# EasyEDA Pro project split-keyboard.epro, board PCB8_2
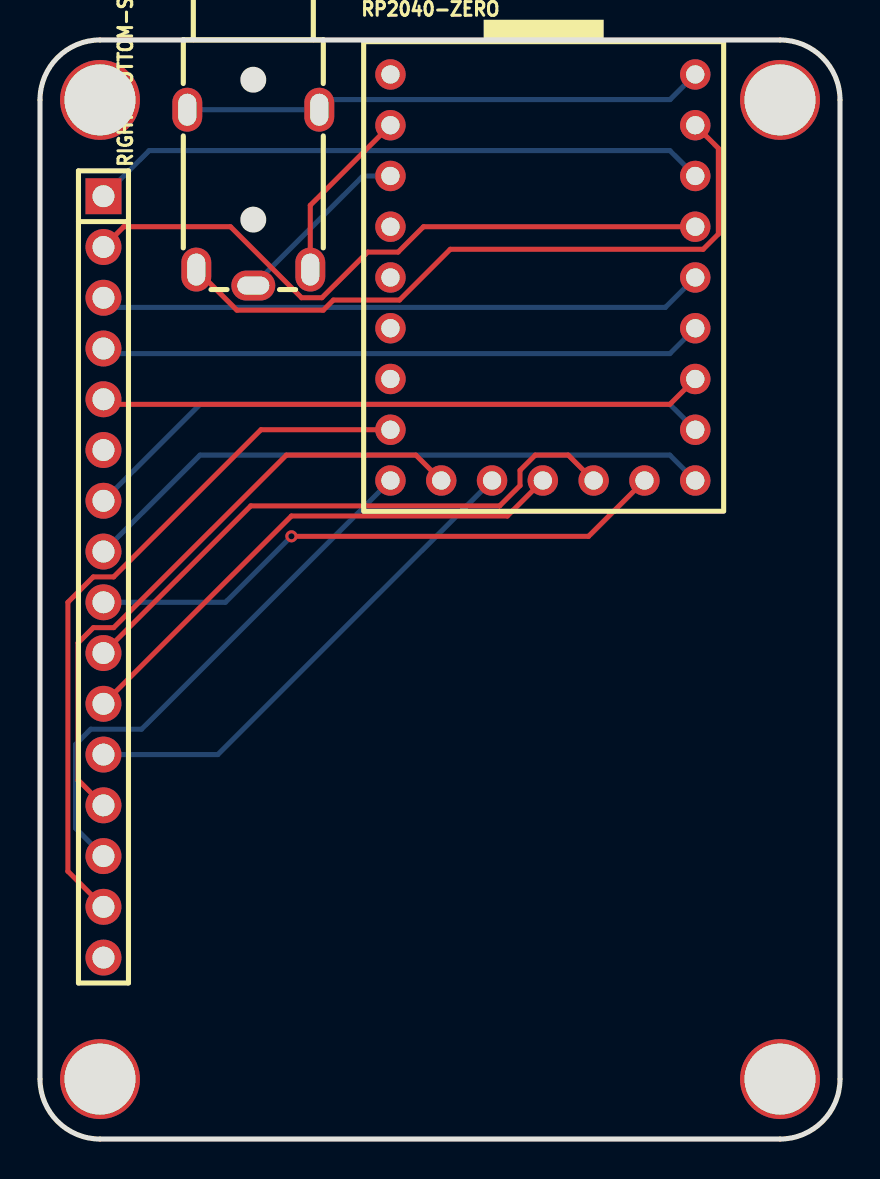
[diagram p9: board, top side]
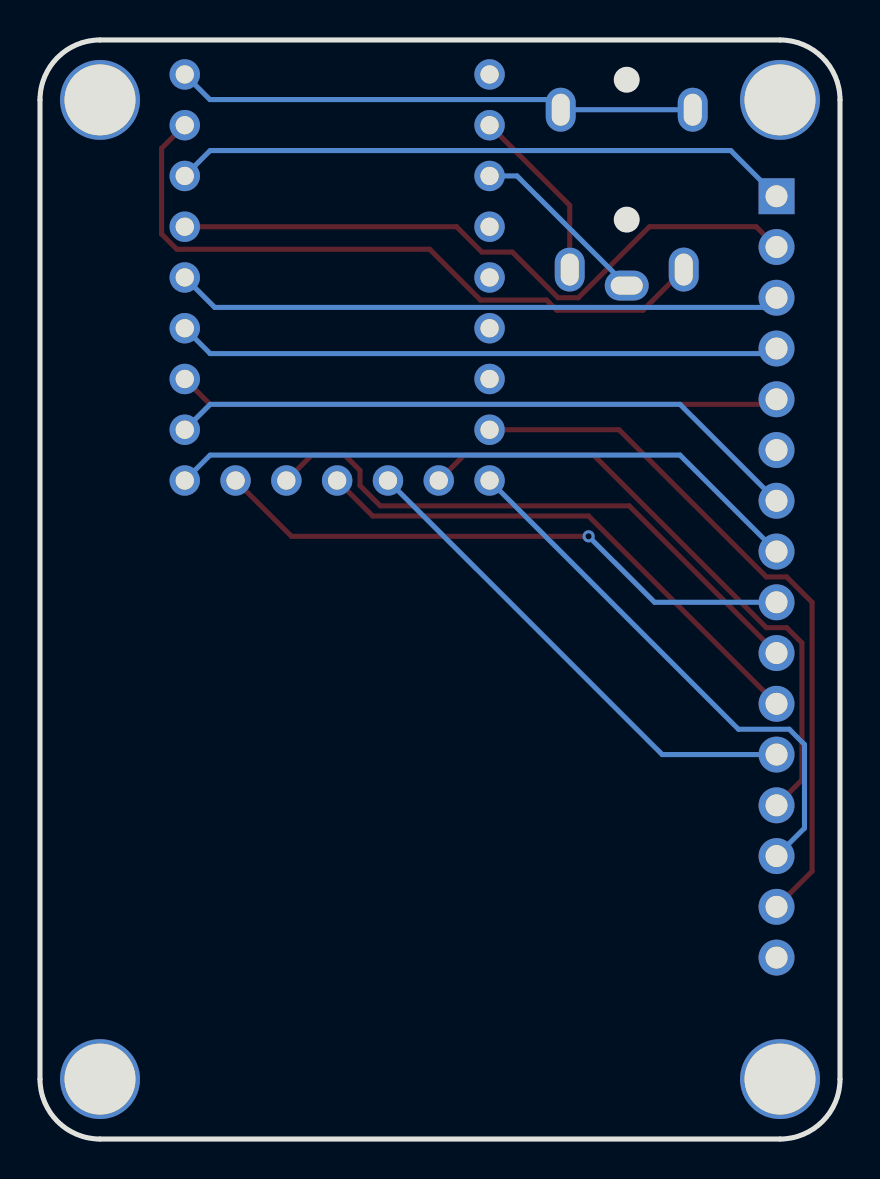
[diagram p10: board, bottom side, seen from below]

Outline 40 x 55 mm; copper layers: Top Layer, Bottom Layer. Coordinates in mm from the lower left corner of the outline.
Outline path: 0,52 0,3 arc(0.88,0.88) 3,0 37,0 arc(39.12,0.88) 40,3 40,52 arc(39.12,54.12) 37,55 3,55 arc(0.88,54.12) 0,52
Stack: Top Layer 0.035mm / Dielectric1 1.51mm FR4 er 4.5 / Bottom Layer 0.035mm

## Design rules (mm)
template: JLCPCB Capability(Two Layers Board)
spacing copperThickness1oz (default): track to track 0.102, other pairs 0.152 to 0.3
spacing copperThickness2oz: track to track 0.203, other pairs 0.152 to 0.3
track width copperThickness1oz (default): min 0.127, default 0.254, max 2.54
track width copperThickness2oz: min 0.203, default 0.254, max 2.54
differential pair differentialPair (default): width min 0.127, default 0.254, max 2.54; gap min 0.152, default 0.152
via viaSize (default): diameter min 0.5, default 0.61, max 10; hole min 0.3, default 0.305, max 6.3

## Placement (name value [footprint] x y rotation side)
NOREF  -  [Pad_e8]  37 52 0 top
NOREF#2  -  [Pad_e3]  3 52 0 top
NOREF#3  -  [Pad_e11]  37 3 0 top
NOREF#4  -  [Pad_e10]  3 3 0 top
RIGHT-AUX  PJ-322A-G  [AUDIO-TH_PJ-322A-Y]  10.66 47.11 270 top
RIGHT-BOTTOM-SOCKET  DS1021-1x16SF11-B  [HDR-TH_16P-P2.54-V-M]  3.17 28.13 270 top
RP2040-ZERO  -  [RP2040-Zero]  14.98 30.41 0 top

## Footprints (pads in the part's own frame, mm; a bottom-side part is the same pattern mirrored in y, then rotated)
AUDIO-TH_PJ-322A-Y
  oval 1.5x2.2 hole 0.9x1.6: 1(4.4,0)
  oval 2.2x1.5 hole 1.6x0.9: 2(3.6,2.85) 3(-4.4,3.3) 3(-4.4,-3.3) 4(3.6,-2.85)
HDR-TH_16P-P2.54-V-M
  rect 1.8x1.8 hole 1.1: 1(-19.05,0)
  round 1.8 hole 1.1: 2(-16.51,0) 3(-13.97,0) 4(-11.43,0) 5(-8.89,0) 6(-6.35,0) 7(-3.81,0) 8(-1.27,0) 9(1.27,0) 10(3.81,0) 11(6.35,0) 12(8.89,0) 13(11.43,0) 14(13.97,0) 15(16.51,0) 16(19.05,0)
Pad_e3
  round 4 hole 3.55: 1(0,0)
Pad_e8
  round 4 hole 3.55: 2(0,0)
Pad_e10
  round 4 hole 3.55: 2(0,0)
Pad_e11
  round 4 hole 3.55: 3(0,0)
RP2040-Zero
  round 1.524 hole 0.914: 1(17.78,22.86) 2(17.78,20.32) 3(17.78,17.78) 4(17.78,15.24) 5(17.78,12.7) 6(17.78,10.16) 7(17.78,7.62) 8(17.78,5.08) 9(17.78,2.54) 10(15.24,2.54) 11(12.7,2.54) 12(10.16,2.54) 13(7.62,2.54) 14(5.08,2.54) 15(2.54,2.54) 16(2.54,5.08) 17(2.54,7.62) 18(2.54,10.16) 19(2.54,12.7) 20(2.54,15.24) 21(2.54,17.78) 22(2.54,20.32) 23(2.54,22.86)

## Nets
As in the schematic.

Pads without a net: NOREF 2; NOREF#2 1; NOREF#3 3; NOREF#4 2; RIGHT-BOTTOM-SOCKET 6 16; RP2040-ZERO 17 18 19 20 23

## Via types
v1: diameter 0.61, hole 0.305, Top Layer to Bottom Layer, 1 via

## Routing (per net, layer and track width the routed paths; a pad name or vN(x,y) marks a point on that pad's centre or on a via; arc(x,y) is an arc through that point)
3V3: length 9.1
  Bottom Layer w0.254: RP2040-ZERO.21 16.15,48.19 RIGHT-AUX.1
GND: length 8.9
  Top Layer w0.254: RP2040-ZERO.22 13.51,46.73 RIGHT-AUX.2
COL0: length 32.1
  Bottom Layer w0.254: RP2040-ZERO.8 31.49,36.77 8,36.77 RIGHT-BOTTOM-SOCKET.7
COL1: length 32.1
  Bottom Layer w0.254: RIGHT-BOTTOM-SOCKET.8 8,34.23 31.49,34.23 RP2040-ZERO.9
COL2: length 29.6
  Top Layer w0.254: v1(12.57,30.16) 27.43,30.16 RP2040-ZERO.10
  Bottom Layer w0.254: RIGHT-BOTTOM-SOCKET.9 9.27,26.86 v1(12.57,30.16)
COL3: length 29.6
  Top Layer w0.254: RP2040-ZERO.11 26.41,34.23 24.76,34.23 24,33.46 24,32.7 22.99,31.69 10.54,31.69 RIGHT-BOTTOM-SOCKET.10
COL4: length 26.6
  Top Layer w0.254: RP2040-ZERO.12 23.37,31.18 12.57,31.18 RIGHT-BOTTOM-SOCKET.11
COL5: length 25.1
  Bottom Layer w0.254: RP2040-ZERO.13 8.89,19.24 RIGHT-BOTTOM-SOCKET.12
COL6: length 31.2
  Top Layer w0.254: RP2040-ZERO.14 18.79,34.23 12.32,34.23 3.68,25.59 2.67,25.59 1.9,24.83 1.9,17.97 RIGHT-BOTTOM-SOCKET.13
COL7: length 27.4
  Bottom Layer w0.254: RIGHT-BOTTOM-SOCKET.14 1.78,15.56 1.78,19.75 2.54,20.51 5.08,20.51 RP2040-ZERO.15
COL8: length 35.7
  Top Layer w0.254: RIGHT-BOTTOM-SOCKET.15 1.4,13.4 1.4,26.86 2.67,28.13 3.68,28.13 11.05,35.49 RP2040-ZERO.16
ROW0: length 31.1
  Bottom Layer w0.254: RP2040-ZERO.3 31.49,49.47 5.46,49.47 RIGHT-BOTTOM-SOCKET.1
ROW1: length 33
  Top Layer w0.254: RIGHT-BOTTOM-SOCKET.2 4.19,45.66 9.52,45.66 13.08,42.1 14.1,42.1 16.38,44.39 17.91,44.39 19.17,45.65 RP2040-ZERO.4
ROW2: length 30.4
  Bottom Layer w0.254: RIGHT-BOTTOM-SOCKET.3 3.66,41.62 31.27,41.62 RP2040-ZERO.5
ROW3: length 30.2
  Bottom Layer w0.254: RIGHT-BOTTOM-SOCKET.4 3.43,39.31 31.49,39.31 RP2040-ZERO.6
ROW4: length 30.2
  Top Layer w0.254: RIGHT-BOTTOM-SOCKET.5 3.43,36.77 31.49,36.77 RP2040-ZERO.7
RX0: length 34.5
  Top Layer w0.254: RIGHT-AUX.4 9.85,41.48 14.16,41.48 14.67,41.99 17.97,41.99 20.51,44.53 33.16,44.53 33.92,45.29 33.92,49.58 RP2040-ZERO.2
TX0: length 26.1
  Bottom Layer w0.254: 7.36,51.51 RIGHT-AUX.3 14.47,52.02 31.51,52.02 RP2040-ZERO.1
